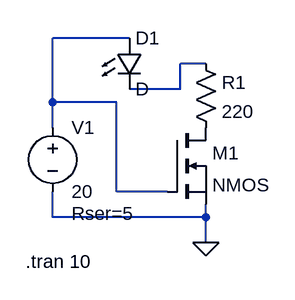
[diagram p0: schematic Draft1.asc]
Draft1.asc, the LTspice schematic file:
Version 4
SHEET 1 880 680
WIRE 112 16 16 16
WIRE 208 48 176 48
WIRE 176 80 176 48
WIRE 176 80 112 80
WIRE 16 96 16 16
WIRE 96 96 16 96
WIRE 16 128 16 96
WIRE 96 208 96 96
WIRE 160 208 96 208
WIRE 16 240 16 208
WIRE 208 240 208 224
WIRE 208 240 16 240
WIRE 208 272 208 240
FLAG 208 272 0
SYMBOL nmos 160 128 R0
SYMATTR InstName M1
SYMBOL voltage 16 112 R0
WINDOW 123 0 0 Left 0
WINDOW 39 24 124 Left 2
SYMATTR InstName V1
SYMATTR Value 20
SYMATTR SpiceLine Rser=5
SYMBOL LED 96 16 R0
SYMATTR InstName D1
SYMBOL res 192 32 R0
SYMATTR InstName R1
SYMATTR Value 220
TEXT -18 296 Left 2 !.tran 10

The netlist it stands for:
* Draft1.asc
M1 P001 N001 0 0 NMOS
V1 N001 0 20 Rser=5
D1 N001 N002 D
R1 N002 P001 220
.model D D
.lib standard.dio
.model NMOS NMOS
.model PMOS PMOS
.lib standard.mos
.tran 10
.backanno
.end